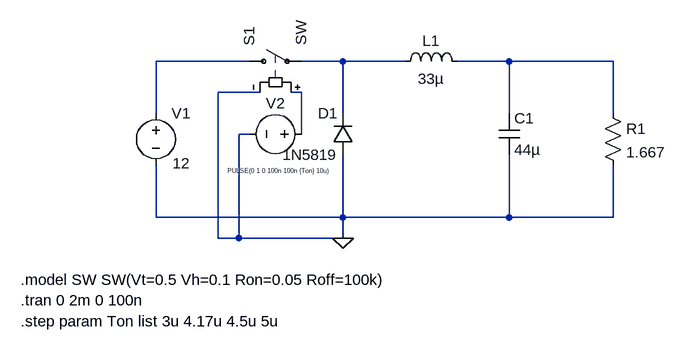
[diagram p0: schematic buckConverter.asc]
buckConverter.asc, the LTspice schematic file:
Version 4.1
SHEET 1 888 680
WIRE 240 64 96 64
WIRE 384 64 320 64
WIRE 480 64 384 64
WIRE 640 64 560 64
WIRE 800 64 640 64
WIRE 256 112 192 112
WIRE 320 112 304 112
WIRE 96 144 96 64
WIRE 384 144 384 64
WIRE 640 144 640 64
WIRE 800 144 800 64
WIRE 240 176 224 176
WIRE 320 176 320 112
WIRE 96 304 96 224
WIRE 384 304 384 208
WIRE 384 304 96 304
WIRE 640 304 640 208
WIRE 640 304 384 304
WIRE 800 304 800 224
WIRE 800 304 640 304
WIRE 192 336 192 112
WIRE 224 336 224 176
WIRE 224 336 192 336
WIRE 384 336 384 304
WIRE 384 336 224 336
FLAG 384 336 0
SYMBOL voltage 96 128 R0
WINDOW 3 26 93 Left 2
WINDOW 123 0 0 Left 0
WINDOW 39 0 0 Left 0
SYMATTR Value 12
SYMATTR InstName V1
SYMBOL sw 224 64 R270
SYMATTR InstName S1
SYMBOL diode 400 208 R180
WINDOW 0 24 64 Left 2
WINDOW 3 24 0 Left 2
SYMATTR InstName D1
SYMATTR Value 1N5819
SYMBOL ind 464 80 R270
WINDOW 0 32 56 VTop 2
WINDOW 3 5 56 VBottom 2
SYMATTR InstName L1
SYMATTR Value 33µ
SYMATTR SpiceLine Rser=0.05
SYMBOL cap 624 144 R0
SYMATTR InstName C1
SYMATTR Value 44µ
SYMATTR SpiceLine Rser=0.05
SYMBOL res 784 128 R0
SYMATTR InstName R1
SYMATTR Value 1.667
SYMBOL voltage 336 176 R90
WINDOW 0 -32 56 VBottom 2
WINDOW 3 50 50 VTop 0
WINDOW 123 0 0 Left 0
WINDOW 39 0 0 Left 0
SYMATTR InstName V2
SYMATTR Value PULSE(0 1 0 100n 100n {Ton} 10u)
TEXT -112 400 Left 2 !.model SW SW(Vt=0.5 Vh=0.1 Ron=0.05 Roff=100k)
TEXT -112 432 Left 2 !.tran 0 2m 0 100n
TEXT -112 464 Left 2 !.step param Ton list 3u 4.17u 4.5u 5u

The netlist it stands for:
* buckConverter.asc
V1 N001 0 12
S1 N001 N002 N004 0 SW
D1 0 N002 1N5819
L1 N002 N003 33µ Rser=0.05
C1 N003 0 44µ Rser=0.05
R1 N003 0 1.667
V2 N004 0 PULSE(0 1 0 100n 100n {Ton} 10u)
.model D D
.lib standard.dio
.model SW SW(Vt=0.5 Vh=0.1 Ron=0.05 Roff=100k)
.tran 0 2m 0 100n
.step param Ton list 3u 4.17u 4.5u 5u
.backanno
.end